# Altium schematic sheet led.SchDoc
size A4
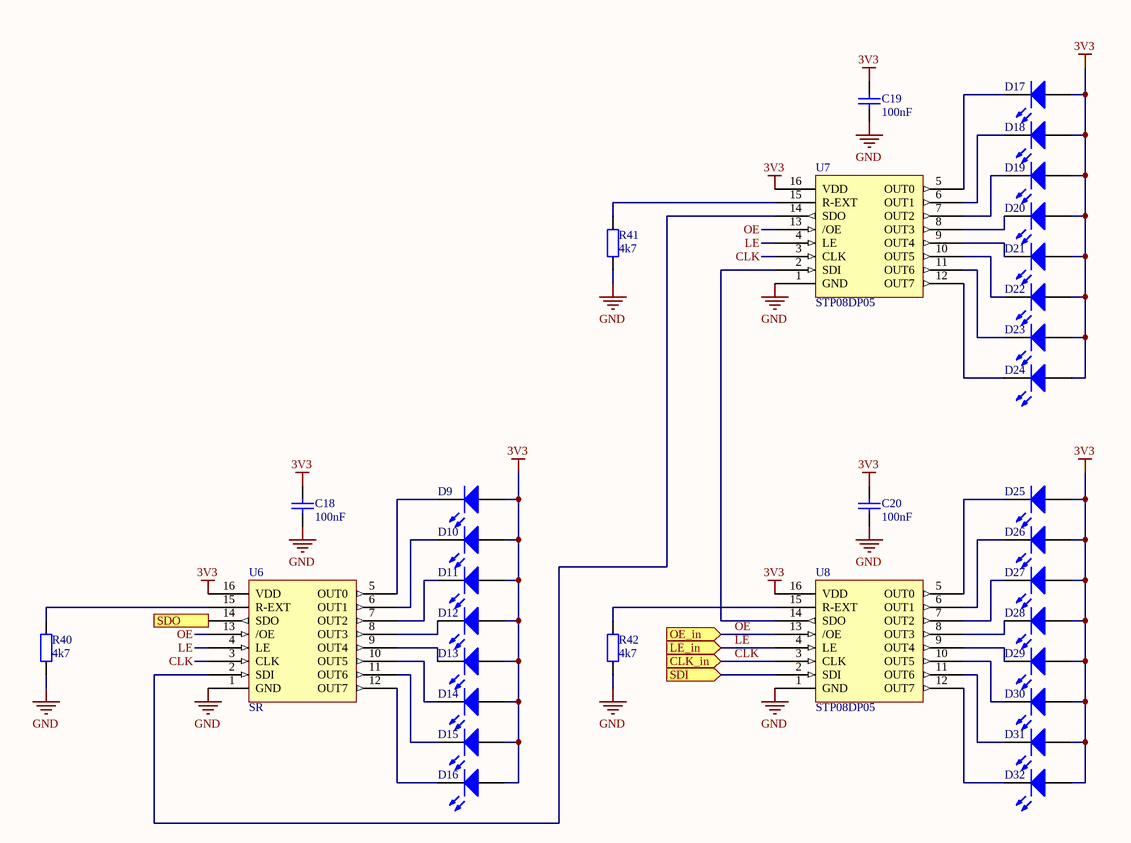
[diagram p0: led.SchDoc]

## Parts
C18  100nF  [FP_0805_CAP_085]
C19  100nF  [FP_0805_CAP_085]
C20  100nF  [FP_0805_CAP_085]
D9  LED  [FP_0805_LED_RED]  (value not drawn)
D10  LED  [FP_0805_LED_RED]  (value not drawn)
D11  LED  [FP_0805_LED_RED]  (value not drawn)
D12  LED  [FP_0805_LED_RED]  (value not drawn)
D13  LED  [FP_0805_LED_RED]  (value not drawn)
D14  LED  [FP_0805_LED_RED]  (value not drawn)
D15  LED  [FP_0805_LED_RED]  (value not drawn)
D16  LED  [FP_0805_LED_RED]  (value not drawn)
D17  LED  [FP_0805_LED_RED]  (value not drawn)
D18  LED  [FP_0805_LED_RED]  (value not drawn)
D19  LED  [FP_0805_LED_RED]  (value not drawn)
D20  LED  [FP_0805_LED_RED]  (value not drawn)
D21  LED  [FP_0805_LED_RED]  (value not drawn)
D22  LED  [FP_0805_LED_RED]  (value not drawn)
D23  LED  [FP_0805_LED_RED]  (value not drawn)
D24  LED  [FP_0805_LED_RED]  (value not drawn)
D25  LED  [FP_0805_LED_RED]  (value not drawn)
D26  LED  [FP_0805_LED_RED]  (value not drawn)
D27  LED  [FP_0805_LED_RED]  (value not drawn)
D28  LED  [FP_0805_LED_RED]  (value not drawn)
D29  LED  [FP_0805_LED_RED]  (value not drawn)
D30  LED  [FP_0805_LED_RED]  (value not drawn)
D31  LED  [FP_0805_LED_RED]  (value not drawn)
D32  LED  [FP_0805_LED_RED]  (value not drawn)
R40  4k7  [FP_0805_RES]
R41  4k7  [FP_0805_RES]
R42  4k7  [FP_0805_RES]
U6  SR  [TSSOP16_2]
U7  STP08DP05  [TSSOP16_2]
U8  STP08DP05  [TSSOP16_2]

## Ports
CLK_in (in), LE_in (in), OE_in (in), SDI (in), SDO (out)

## Nets
3V3: C18.2 C19.2 C20.2 D9.1(A) D10.1(A) D11.1(A) D12.1(A) D13.1(A) D14.1(A) D15.1(A) D16.1(A) D17.1(A) D18.1(A) D19.1(A) D20.1(A) D21.1(A) D22.1(A) D23.1(A) D24.1(A) D25.1(A) D26.1(A) D27.1(A) D28.1(A) D29.1(A) D30.1(A) D31.1(A) D32.1(A) U6.16(VDD) U7.16(VDD) U8.16(VDD)
GND: C18.1 C19.1 C20.1 R40.2 R41.2 R42.2 U6.1(GND) U7.1(GND) U8.1(GND)
CLK: U6.3(CLK) U7.3(CLK) U8.3(CLK) ; port CLK_in
LE: U6.4(LE) U7.4(LE) U8.4(LE) ; port LE_in
OE: U6.13(/OE) U7.13(/OE) U8.13(/OE) ; port OE_in
SDI: U8.2(SDI) ; port SDI
SDO: U6.14(SDO) ; port SDO
NetD9_2: D9.2(K) U6.5(OUT0)
NetD10_2: D10.2(K) U6.6(OUT1)
NetD11_2: D11.2(K) U6.7(OUT2)
NetD12_2: D12.2(K) U6.8(OUT3)
NetD13_2: D13.2(K) U6.9(OUT4)
NetD14_2: D14.2(K) U6.10(OUT5)
NetD15_2: D15.2(K) U6.11(OUT6)
NetD16_2: D16.2(K) U6.12(OUT7)
NetD17_2: D17.2(K) U7.5(OUT0)
NetD18_2: D18.2(K) U7.6(OUT1)
NetD19_2: D19.2(K) U7.7(OUT2)
NetD20_2: D20.2(K) U7.8(OUT3)
NetD21_2: D21.2(K) U7.9(OUT4)
NetD22_2: D22.2(K) U7.10(OUT5)
NetD23_2: D23.2(K) U7.11(OUT6)
NetD24_2: D24.2(K) U7.12(OUT7)
NetD25_2: D25.2(K) U8.5(OUT0)
NetD26_2: D26.2(K) U8.6(OUT1)
NetD27_2: D27.2(K) U8.7(OUT2)
NetD28_2: D28.2(K) U8.8(OUT3)
NetD29_2: D29.2(K) U8.9(OUT4)
NetD30_2: D30.2(K) U8.10(OUT5)
NetD31_2: D31.2(K) U8.11(OUT6)
NetD32_2: D32.2(K) U8.12(OUT7)
NetR40_1: R40.1 U6.15(R-EXT)
NetR41_1: R41.1 U7.15(R-EXT)
NetR42_1: R42.1 U8.15(R-EXT)
NetU6_2: U6.2(SDI) U7.14(SDO)
NetU7_2: U7.2(SDI) U8.14(SDO)

## Library data of the parts
C18-C20 = CAP: Capacitor; Value: 100nF
D9-D32 = LED: Typical RED GaAs LED; pin to pad: 1>A 2>K
R40-R42 = RES: Resistor; Value: 4k7
U6-U8 = STP08DP05: LED driver [8]